# Altium schematic sheet relay_solenoid.SchDoc: Solenoid driving circuit
size 431 x 279 mm; Date: 02/15/2021; DrawnBy: Team KOIN; Organization: University of Pennsylvania; DocumentNumber: 6; Revision: 2; SheetNumber: 7; SheetTotal: 8
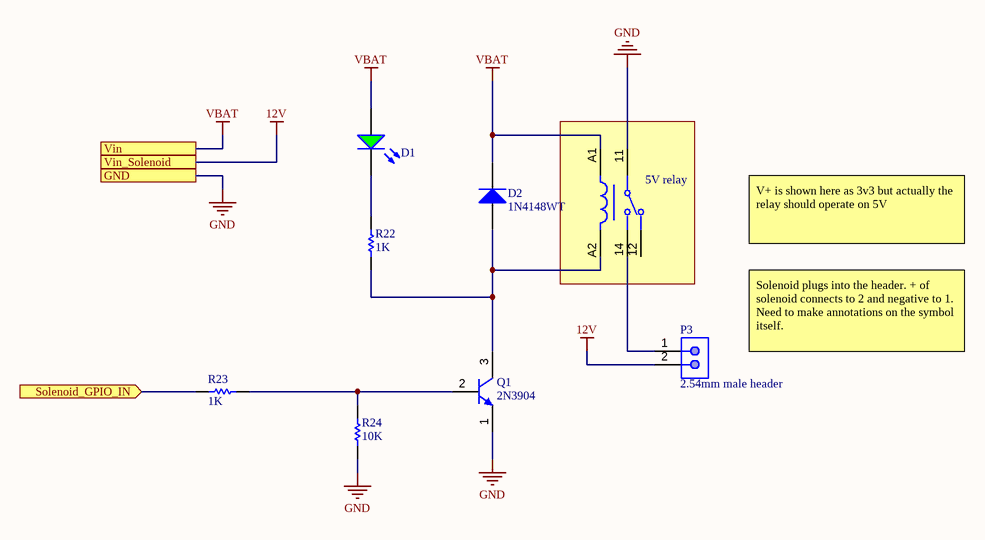
[diagram p0: relay_solenoid.SchDoc]

## Parts
5V_relay  5-1393224-2  [FP-5-1393224-2-MFG]  (value not drawn)
D1  LTST-C170GKT  [LTST-C170GKT_V]  (value not drawn)
D2  1N4148WT  [FAIR-SOD-523F-2_V]
P3  2.54mm male header  [MOLX-22-23-2021_V]
Q1  2N3904  [ONSC-TO-92-3-29-11]
R22  1K  [RESC0603(1608)_M]
R23  1K  [RESC0603(1608)_M]
R24  10K  [RESC0603(1608)_N]

## Ports
GND, Solenoid_GPIO_IN (in), Vin, Vin_Solenoid

## Nets
12V: P3.2 ; port Vin_Solenoid
GND: 5V_relay.11 Q1.1(E) R24.1 ; port GND
VBAT: 5V_relay.A1 D1.1(A) D2.1(K) ; port Vin
Solenoid_GPIO_IN: R23.1 ; port Solenoid_GPIO_IN
Net5V_relay_14: 5V_relay.14 P3.1
Net5V_relay_A2: 5V_relay.A2 D2.2(A) Q1.3(C) R22.1
NetD1_2: D1.2(K) R22.2
NetQ1_2: Q1.2(B) R23.2 R24.2

Not connected (* = marked no-connect by the designer): 5V_relay 12

## Notes on the sheet
- V+ is shown here as 3v3 but actually the relay should operate on 5V
- Solenoid plugs into the header. + of solenoid connects to 2 and negative to 1. Need to make annotations on the symbol itself.
- DWG. NO.
- REV.
- SHT.
- THIS DOCUMENT AND THE DATA DISCLOSED HEREIN OR HEREWITH IS THE PROPERTY OF ALTIUM LIMITED AND MAY BE FREELY DISTRIBUTED IN WHOLE. NO RIGHTS ARE RESERVED OR EXPRESS OR IMPLIED WARANTEE GIVEN.
- REVISION
- DESCRIPTION
- DATE
- APPROVED
- ENG:
- APPROVALS
- PROJECT
- DSN:
- CHK:
- REFERENCE DOCUMENTS
- PROJECT REVISION:
- TITLE
- DOCUMENT REVISION:
- DESIGN ITEM:
- BOM:
- FAB DWG:
- PCB DWG:
- ASSY DWG:
- SCALE:
- SIZE
- B
- CAGE CODE
- FILE NAME
- DWG NO.
- SHEET
- OF
- REV

## Library data of the parts
5V_relay = CMP-03395-000017-1: RELAY GENERAL PURPOSE SPDT 8A 5V; Manufacturer: TE; Coil Power: 223mW; Coil Type: Non-Latching; Number Of Contacts: 1; Coil Resistance: 112Ω; Height: 12.3mm; Device Class L1: Electromechanical; Octopart: https://octopart.com/ry212005-te+connectivity-39636608; Lead Free: Yes; Ambient Temperature Range High: +70°C; Package: 5-1393224-2; Automotive: No; Device Class L3: Power Relays; Current Rating: 8A; ComponentLink2URL: https://www.te.com/usa-en/product-5-1393224-2.html?te_bu=Cor&te_type=other&te_campaign=oct_glo_cor-oct-global-oth-prtnr-fy19-oct-octo-buy-bom_sma-298_2&elqCampaignId=35216; Ambient Temperature Range Low: -40°C; Coil Voltage: 5V; Manufacturer Part Number: 5-1393224-2; Throw Configuration: SPDT; Digikey Description: RELAY GENERAL PURPOSE SPDT 8A 5V; Category: Relay; RoHS: TRUE; Device Class L2: Relays; ComponentLink2Description: Datasheet
D1 = CMP-1674-00002-5: LED Uni-Color Green, 100 mW, 120 mA, -55 to 85 degC, 2-Pin SMD, RoHS, Tape and Reel; Manufacturer: Lite-On; PackageReference: C170GKT; ComponentLink1Description: Manufacturer URL; ComponentLink1URL: http://www.us.liteon.com/; Height: 1.1 mm; PackageDescription: 2-Pin Surface Mount Device, Body 2 x 1.25 mm; RoHSCompliant: true; Package Quantity: 1; Packaging: Tape and Reel; Mount: Surface Mount; Min Operating Temperature: -55 degC; DatasheetVersion: 03/2003; Max Operating Temperature: 85 degC; Pins: 2; Mounting Technology: Surface Mount; Length: 2 mm; Colour: Green; ComponentLink2URL: http://media.digikey.com/pdf/Data%20Sheets/Lite-On%20PDFs/LTST-C170GKT.pdf; ComponentLink2Description: Datasheet
D2 = CMP-0881-00001-1: High Conductance Fast Switching Diode, 75 V, -55 to 150 degC, 2-Pin SOD523F, RoHS; Manufacturer: Fairchild Semiconductor; IR (VR: 75 V)=5 uA Max.; VF: 1 V Max.; BVR (IR: 5 uA)=75 V Min.; CO: 4 pF Max.; DatasheetVersion: Rev. A2; ComponentLink1Description: Manufacturer URL; PackageDescription: 2-Pin Surface Mount Device, Body 1.2 x 0.8 mm, Height 0.7 mm; ComponentLink2URL: http://www.fairchildsemi.com/ds/1N/1N4148WT.pdf; ComponentLink2Description: Datasheet; PartNumber: 1N4148WT; ComponentLink1URL: http://www.fairchildsemi.com/; Temperature Range: -55 to 150 degC; Mounting Technology: Surface Mount; PackageReference: SOD-523F-2; RoHS: TRUE
P3 = CMP-1704-00001-1: Male Header, Pitch 2.54 mm, 1 x 2 Position, Height 10.67 mm, Tail Length 3.56 mm, 0 to 75 degC, RoHS, Bulk; Manufacturer: Molex; PackageDescription: Male Header, Pitch 2.54 mm, 1 x 2 Position, Height 10.67 mm, Tail Length 3.56 mm; ComponentLink2URL: https://datasheet.ciiva.com/19454/232266-19454304.pdf; ComponentLink2Description: Datasheet; ComponentLink1Description: Manufacturer URL; PartNumber: 22-23-2021; Mounting Technology: Through Hole; ComponentLink1URL: http://www.molex.com/; PackageReference: 22-23-2021
Q1 = CMP-2000-05562-1: General Purpose Transistor, NPN Silicon, 200 mA, 60 V, -55 to 150 degC, 3-Pin TO-92, RoHS, Bulk; Manufacturer: ONSemiconductor; Emitter- Base Voltage VEBO: 6V; Maximum Power Dissipation: 625mW; Maximum DC Collector Current: 0.2A; Collector- Emitter Voltage VCEO Max: 40V; Collector- Base Voltage VCBO: 60V; DC Collector/Base Gain hfe Min: 60; Configuration: Single; Collector-Emitter Saturation Voltage: 0.3V; Gain Bandwidth Product fT: 270MHz; Mounting Style: ThroughHole; Package / Case: TO-92-3(TO-226); Mounting Technology: ThroughHole; Minimum Operating Temperature: -65C; Datasheet Version: Rev. 8, 08/2012; Product Category: BipolarTransistors-BJT; Factory Pack Quantity: 5000; Transistor Polarity: NPN; Package Description: 3-Pin Transistor Outline, Body 4.825 x 3.685 mm, Pitch 1.27 mm; RoHS: Details; Datasheet URL: https://datasheet.ciiva.com/4725/2n3903-d-285841-4725808.pdf; Packaging: Bulk; Maximum Operating Temperature: +150C; Package Reference: TO-92-3-29-11; Brand: ONSemiconductor; Manufacturer URL: http://www.onsemi.com/
R22 R23 = CMP-1012-00510-1: 1K 0.1W 1% 0603 (1608 Metric)  SMD; Case-Metric: 1608; Case-EIA: 0603; Value: 1000.00 Ohm; Technology: SMT; Tolerance: 1 %; Power: 0.1 W
R24 = CMP-1012-00623-1: 10K 0.1W 1% 0603 (1608 Metric)  SMD; Value: 10000.00 Ohm; Case-EIA: 0603; Case-Metric: 1608; Power: 0.1 W; Tolerance: 1 %; Technology: SMT